# EasyEDA Pro project 1比41开关小板.epro

# Schematic 充电外置开关板
Create Date: 2023-10-29; Page Name: P1; Project Name: 遥控小车驱动小板; Schematic Name: Schematic1; Update Date: 2023-10-29; Company: 嘉立创EDA; Page Size: A4; Version: V1.0
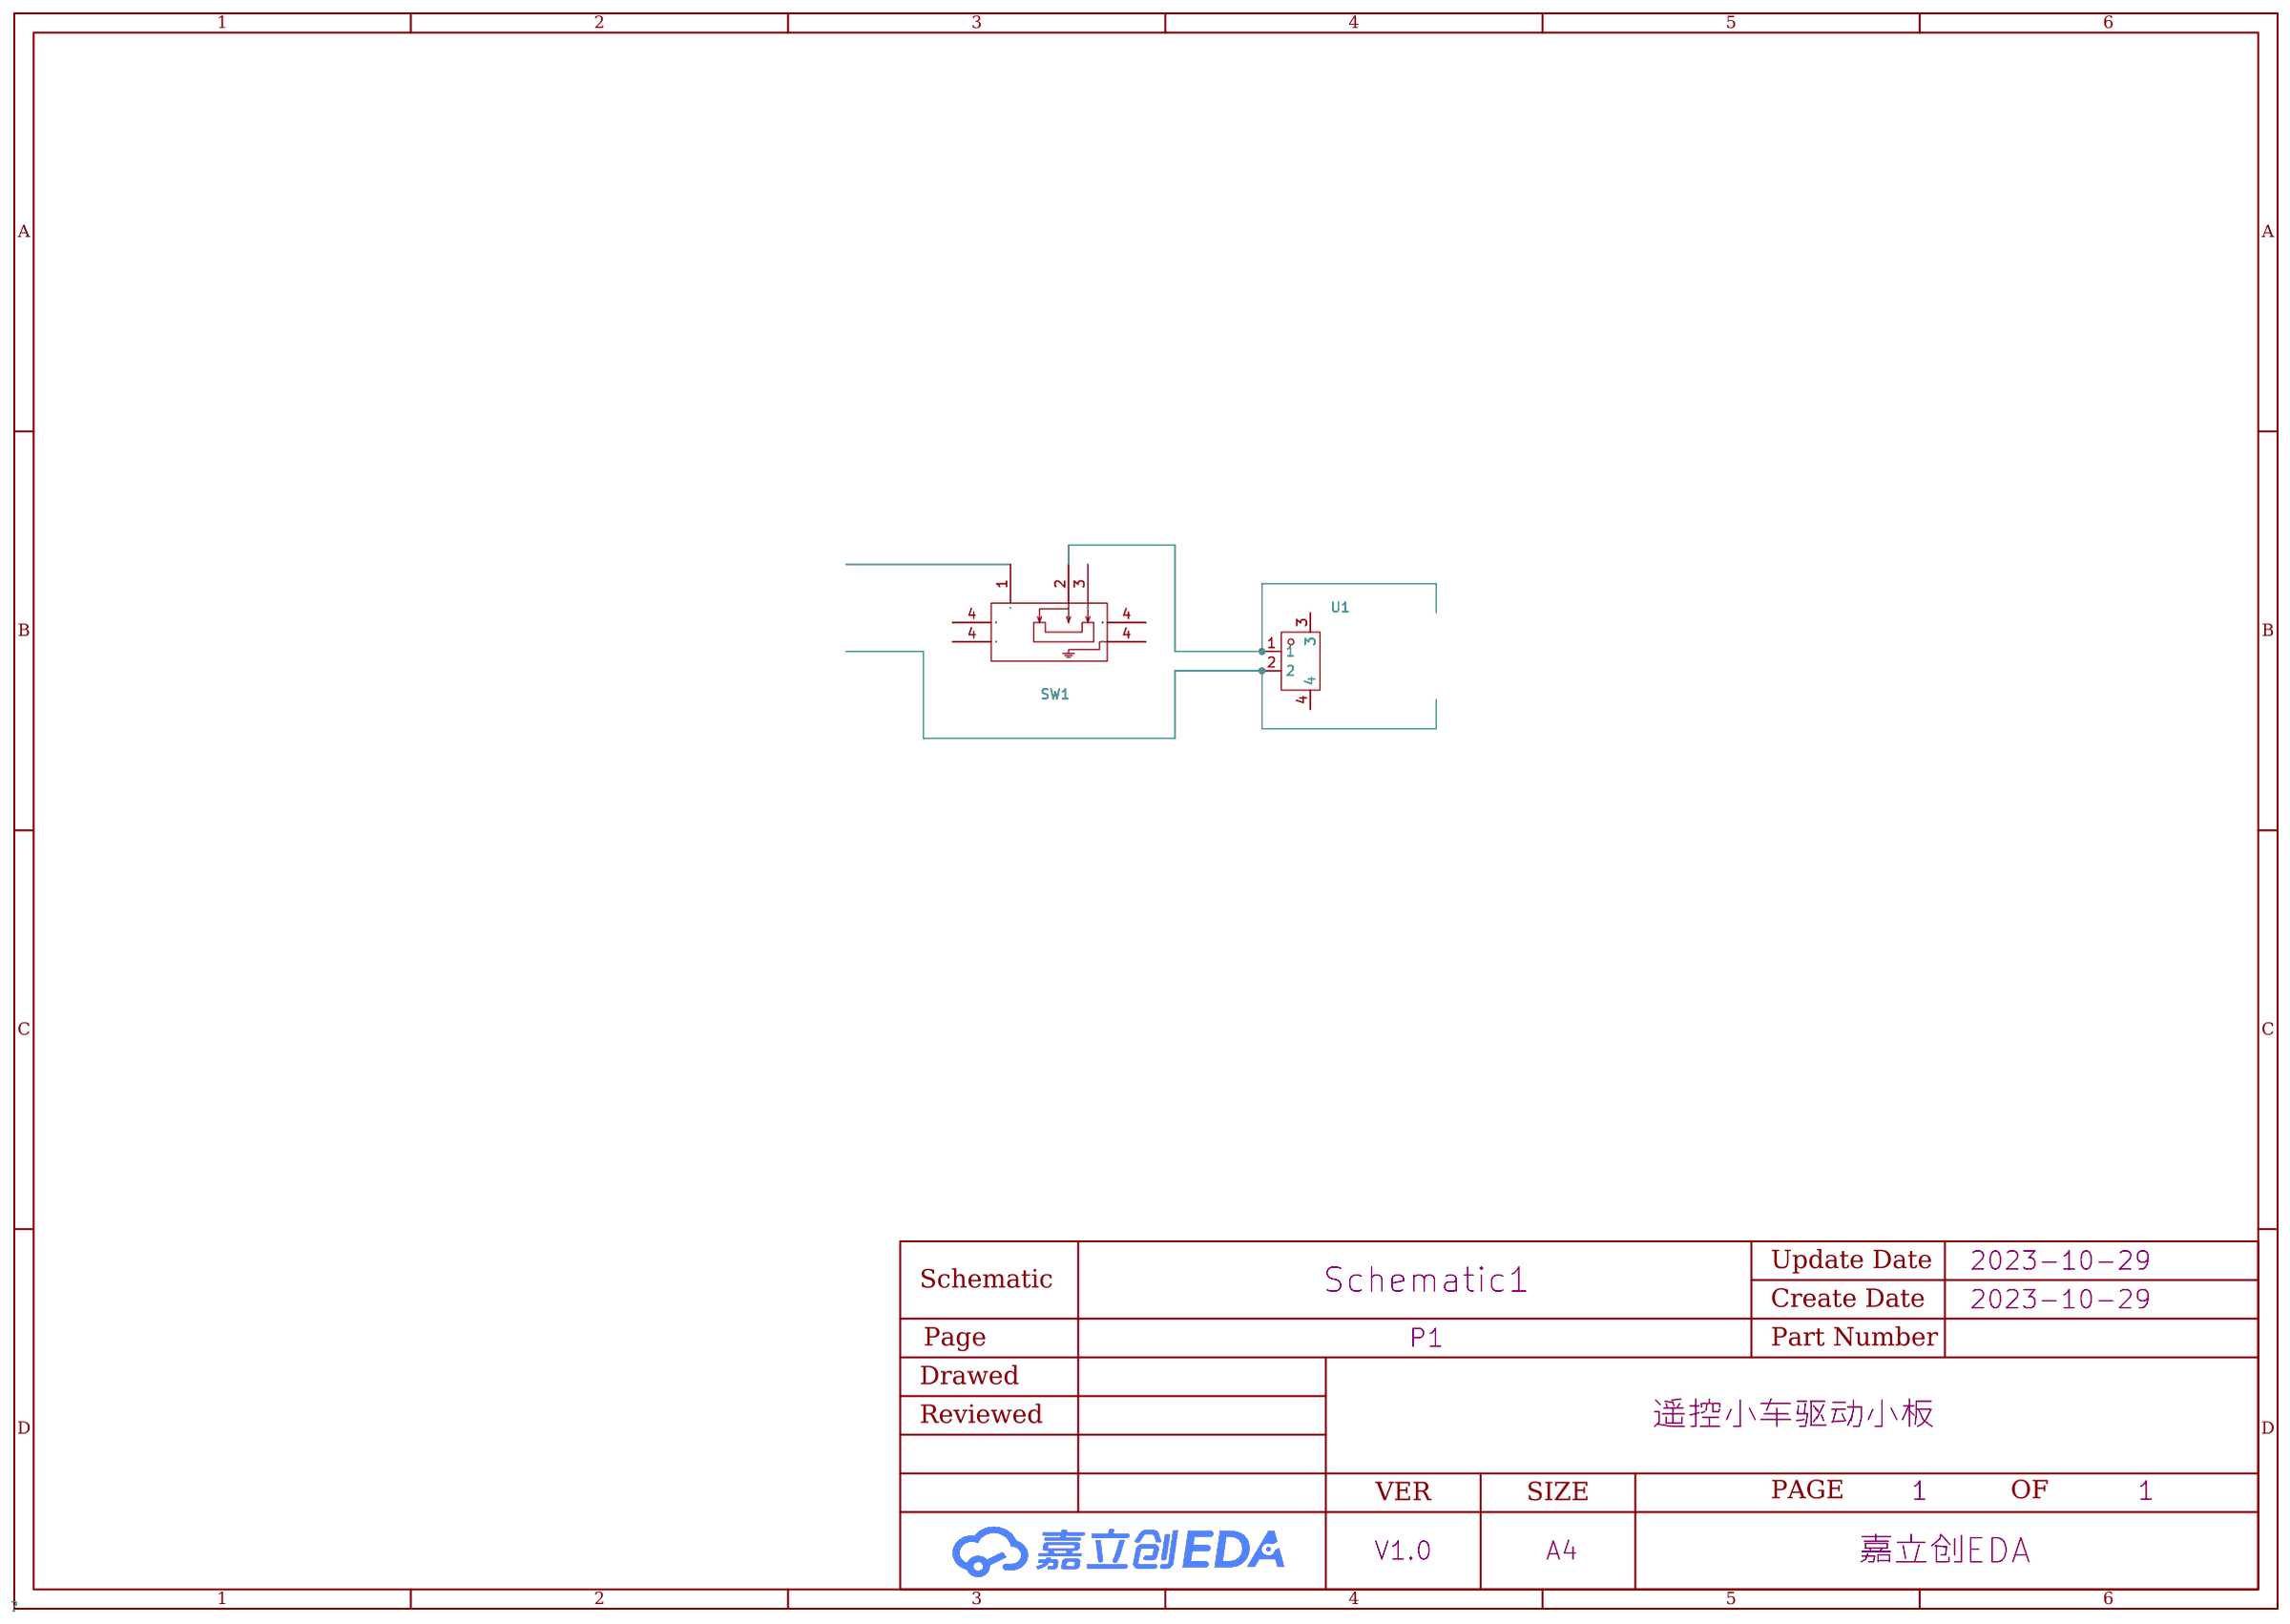
[diagram p0: schematic sheet]

## Parts
SW1  MSK12C02  [SW-TH_MSK12C02]
U1  XD-GH-2PWT  [CONN-SMD_GH-2PWT]

## Library data of the parts
SW1 = MSK12C02: LCSC Part Name: 两档侧拨贴片 7脚 拨动 白柄 柄长1.5mm,带定位柱; Supplier Part: C431540; Manufacturer: SHOU HAN(首韩); Supplier Footprint: SMD; JLCPCB Part Class: Extended Part; Datasheet: https://atta.szlcsc.com/upload/public/pdf/source/20190925/C431540_89155AEF0758B9AD1B2D805F83FB12E3.pdf; Supplier: LCSC
U1 = XD-GH-2PWT: 参考系列:GH;间距:1.25mm;插针结构:1x2P;排数:1;每排PIN数:2;公母:公型插针;安装方式:卧贴;额定电流:1A;触头镀层:锡;工作温度范围:-40℃~+105℃;; LCSC Part Name: 间距:1.25mm 1x2P 卧贴 带扣 线对板/线对线连接器; Supplier Part: C17700380; Manufacturer: XUNDA(讯答); Supplier Footprint: SMD,P=1.25mm; Datasheet: https://atta.szlcsc.com/upload/public/pdf/source/20231019/0574E105206498063B39A8D5088E5395.pdf; Supplier: LCSC; Reference Series: GH; Pitch: 1.25mm; Pins Structure: 1x2P; Number of Rows: 1; Number of PINs Per Row: 2; Gender: 公型插针; Mounting Style: 卧贴; Current Rating (Max): 1A; Contact Plating: 锡; Operating Temperature Range: -40℃~+105℃

## Nets
$1N263: SW1.2 U1.1

Not connected (* = marked no-connect by the designer): SW1 1 3 4; U1 2 3 4

# Board 充电外置开关板
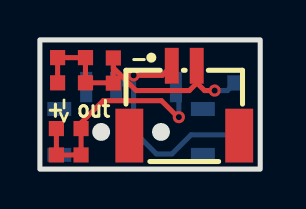
[diagram p1: board, top side]
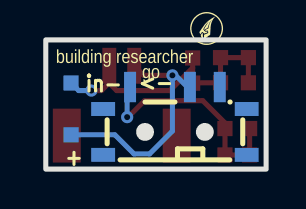
[diagram p2: board, bottom side, seen from below]

Outline 11.05 x 6.48 mm; copper layers: Top Layer, Bottom Layer. Coordinates in mm from the lower left corner of the outline.
Outline path: rectangle 0,6.48 11.05,0
Stack: Top Layer 0.035mm / Dielectric1 1.51mm FR4 er 4.5 / Bottom Layer 0.035mm

## Design rules (mm)
template: JLCPCB Capability(Two Layers Board)
spacing copperThickness1oz (default): track to track 0.102, other pairs 0.152 to 0.3
spacing copperThickness2oz: track to track 0.203, other pairs 0.152 to 0.3
track width copperThickness1oz (default): min 0.127, default 0.254, max 2.54
track width copperThickness2oz: min 0.203, default 0.254, max 2.54
differential pair differentialPair (default): width min 0.127, default 0.254, max 2.54; gap min 0.152, default 0.152
via viaSize (default): diameter min 0.5, default 0.61, max 10; hole min 0.3, default 0.305, max 6.3

## Placement (name value [footprint] x y rotation side)
NOREF  -  [Pad_e19]  3.68 4.31 0 top
NOREF#2  -  [Pad_e20]  2.06 0.71 0 top
NOREF#3  -  [Pad_e15]  2.29 5.59 0 top
NOREF#4  -  [Pad_e9]  9.78 4.32 0 top
NOREF#5  -  [Pad_e18]  2.29 4.33 0 top
NOREF#6  -  [Pad_e21]  0.83 0.71 0 top
NOREF#7  -  [Pad_e17]  0.89 4.33 0 top
NOREF#8  -  [Pad_e23]  0.83 2.03 0 top
NOREF#9  -  [Pad_e11]  9.78 1.72 0 top
NOREF#10  -  [Pad_e22]  2.06 2.03 0 top
NOREF#11  -  [Pad_e16]  0.89 5.59 0 top
NOREF#12  -  [Pad_e12]  3.68 5.57 0 top
SW1  MSK12C02  [SW-TH_MSK12C02]  4.57 2.41 180 bottom
U1  XD-GH-2PWT  [CONN-SMD_GH-2PWT]  7.24 3.43 0 top

## Footprints (pads in the part's own frame, mm; a bottom-side part is the same pattern mirrored in y, then rotated)
CONN-SMD_GH-2PWT
  rect 0.7x1.8 smd: 1(-0.625,1.75) 2(0.625,1.75)
  rect 1.4x2.7 smd: 3(-2.755,-1.75) 4(2.755,-1.75)
Pad_e9
  rect 0.762x0.762 smd far side: 5(0,0)
Pad_e11
  rect 0.762x0.762 smd far side: 5(0,0)
Pad_e12
  rect 0.762x0.762 smd: 5(0,0)
Pad_e15
  rect 0.762x0.762 smd: 5(0,0)
Pad_e16
  rect 0.762x0.762 smd: 5(0,0)
Pad_e17
  rect 0.762x0.762 smd: 5(0,0)
Pad_e18
  rect 0.762x0.762 smd: 5(0,0)
Pad_e19
  rect 0.762x0.762 smd: 5(0,0)
Pad_e20
  rect 0.762x0.762 smd: 5(0,0)
Pad_e21
  rect 0.762x0.762 smd: 5(0,0)
Pad_e22
  rect 0.762x0.762 smd: 5(0,0)
Pad_e23
  rect 0.762x0.762 smd: 5(0,0)
SW-TH_MSK12C02
  rect 0.6x1.524 smd: 1(-2.25,1.7) 2(0.75,1.7) 3(2.25,1.7)
  rect 1.2x0.7 smd: 4(-3.6,-1.7) 4(-3.6,0.6) 4(3.6,-1.7) 4(3.6,0.6)

## Nets
$1N263: NOREF#9.5 SW1.2 U1.1
$1N284: NOREF#2.5 NOREF#6.5 NOREF#8.5 NOREF#10.5 SW1.1
$1N287: NOREF.5 NOREF#3.5 NOREF#4.5 NOREF#5.5 NOREF#7.5 NOREF#11.5 NOREF#12.5 U1.2

Pads without a net: SW1 3 4; U1 3 4

## Via types
v1: diameter 0.61, hole 0.305, Top Layer to Bottom Layer, 3 vias

## Routing (per net, layer and track width the routed paths; a pad name or vN(x,y) marks a point on that pad's centre or on a via; arc(x,y) is an arc through that point)
$1N263: length 11.9
  Top Layer w0.254: v1(4.7,4.7) 6.13,4.7 U1.1
  Bottom Layer w0.254: 3.95,4.11 4.53,4.7 v1(4.7,4.7) 4.7,1.91 5.84,0.76 6.63,0.76 7.58,1.72 NOREF#9.5
$1N284: length 11.4
  Top Layer w0.254: NOREF#8.5 NOREF#6.5 NOREF#2.5 NOREF#10.5 2.06,2.32 3.18,3.43 6.1,3.43 6.92,2.61 v1(6.97,2.61)
  Bottom Layer w0.254: v1(6.97,2.61) 6.97,4.09 6.95,4.11
$1N287: length 14.5
  Top Layer w0.254: 7.86,4.33 8.25,3.94 v1(8.76,3.94) ; 7.86,4.33 7.86,4.31 7.49,3.94 4.83,3.94 3.68,5.08 ; 7.86,4.33 U1.2 ; 3.68,5.08 NOREF.5 3.67,4.33 NOREF#5.5 NOREF#3.5 NOREF#11.5 NOREF#7.5 ; 3.68,5.08 NOREF#12.5
  Bottom Layer w0.254: v1(8.76,3.94) 9.4,3.94 NOREF#4.5

## Text on the board
Bottom Silkscreen Layer: in- | + | -> | go | building researcher
Top Silkscreen Layer: -> | + | - | out
